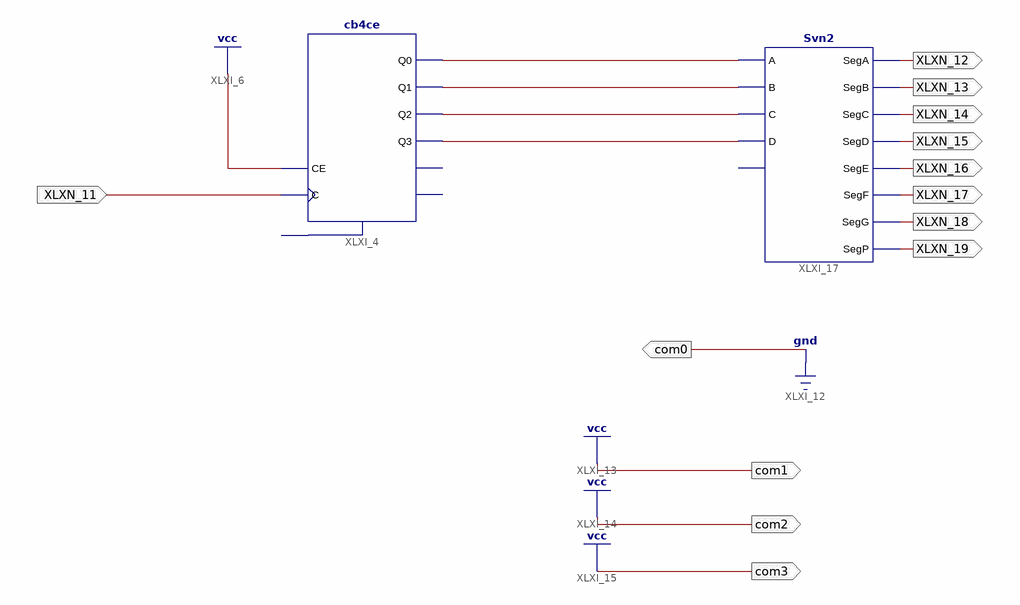
[diagram p0: schematic sheet 1]
// Xilinx ISE schematic res.sch (spartan6) as structural Verilog: 2 symbols, 13 ports
module res (
  input  XLXN_11,
  output XLXN_12,
  output XLXN_13,
  output XLXN_14,
  output XLXN_15,
  output XLXN_16,
  output XLXN_17,
  output XLXN_18,
  output XLXN_19,
  output com0,
  output com1,
  output com2,
  output com3
);

  wire XLXN_20, XLXN_23, XLXN_24, XLXN_25;

  cb4ce XLXI_4 (.C(XLXN_11), .CE(1'b1), .Q0(XLXN_20), .Q1(XLXN_23), .Q2(XLXN_24), .Q3(XLXN_25));  // open: CLR, CEO, TC
  Svn2 XLXI_17 (
    .A(XLXN_20), .B(XLXN_23), .C(XLXN_24), .D(XLXN_25), .SegA(XLXN_12), .SegB(XLXN_13), .SegC(XLXN_14),
    .SegD(XLXN_15), .SegE(XLXN_16), .SegF(XLXN_17), .SegG(XLXN_18), .SegP(XLXN_19));  // open: P

  assign com0 = 1'b0;
  assign com1 = 1'b1;
  assign com2 = 1'b1;
  assign com3 = 1'b1;

  // Notes on the sheet:
  //   CLOCK_DEDICATED_ROUTE on signal XLXN_11 = FALSE
  //   LOC on signal XLXN_11 = P45
  //   LOC on signal XLXN_12 = P41
  //   LOC on signal XLXN_13 = P40
  //   LOC on signal XLXN_14 = P35
  //   LOC on signal XLXN_15 = P34
  //   LOC on signal XLXN_16 = P32
  //   LOC on signal XLXN_17 = P29
  //   LOC on signal XLXN_18 = P27
  //   LOC on signal XLXN_19 = P26
  //   LOC on signal com0 = P44
  //   LOC on signal com1 = P43
  //   LOC on signal com2 = P33
  //   LOC on signal com3 = P30
endmodule
